# EAGLE design os23dc (EAGLE 7.5.0)
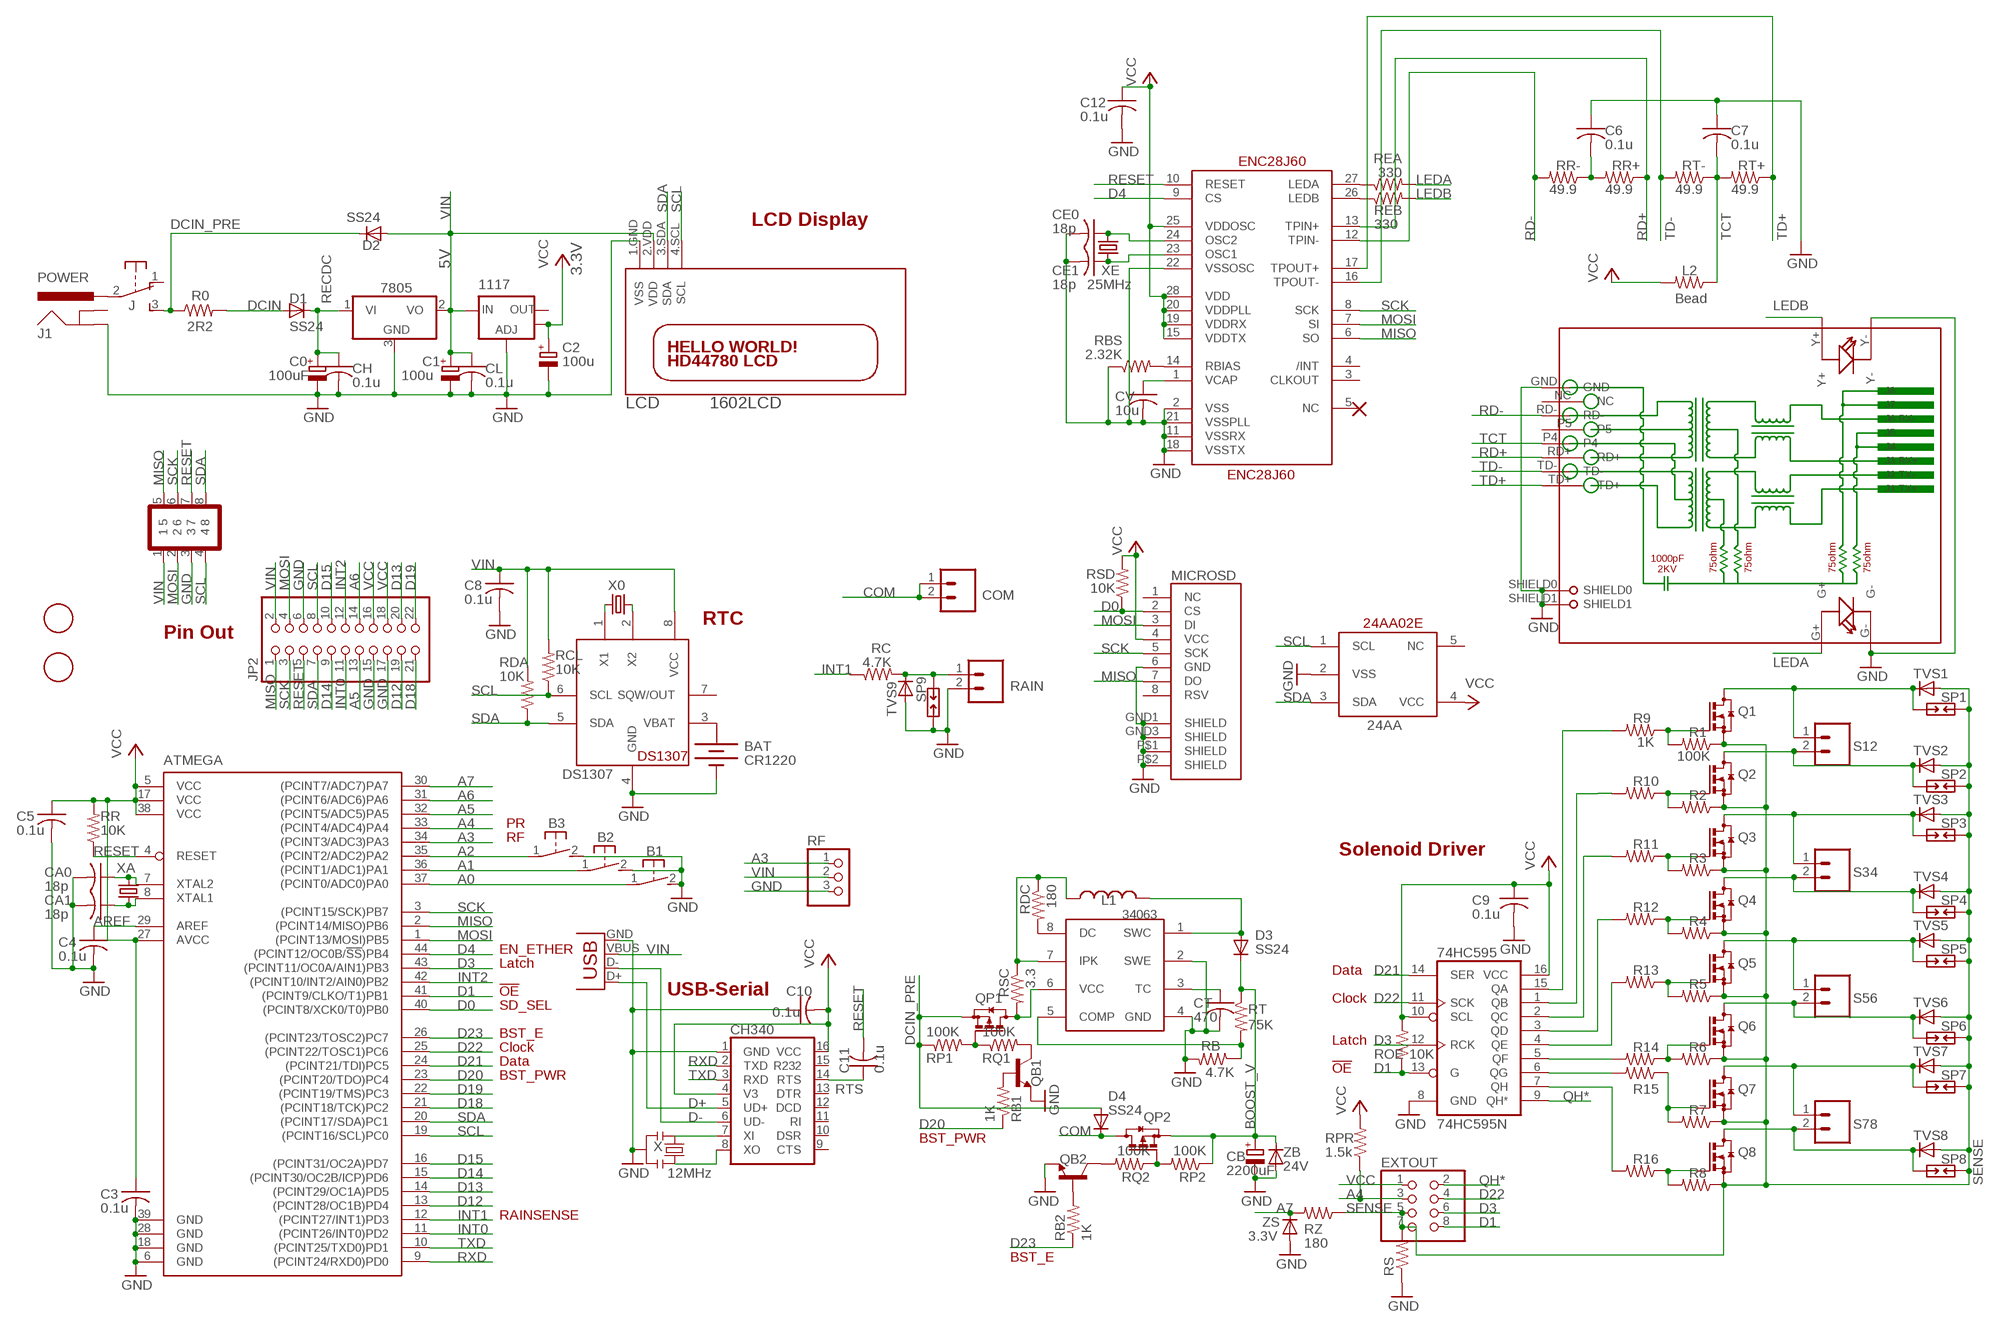
[diagram p0: schematic, sheet 1]

## Parts
24AA  24AA02E48  [SOT23-5L]
74HC595  74HC595N  74LS595D  [SO16]
1117  V_REG_LM1117SOT223  [SOT223]
7805  7805DT  [TO252]
34063  MC33063/MC34063D  [SO08]
ATMEGA  ATMEGA644A  [TQFP44]
B1  31-XX  [B3F-31XX]
B2  31-XX  [B3F-31XX]
B3  31-XX  [B3F-31XX]
BAT  CR1220  BATTERYBATTERY_12MM_SMT  [BATTCON_12MM_SMT]
C0  100uF  CPOL-EUD  [PANASONIC_D]
C1  100u  CPOL-EUD  [PANASONIC_D]
C2  100u  CPOL-EUD  [PANASONIC_D]
C3  0.1u  C-USC0603K  [C0603K]
C4  0.1u  C-USC0603  [C0603]
C5  0.1u  C-USC0603  [C0603]
C6  0.1u  C-USC0603  [C0603]
C7  0.1u  C-USC0603K  [C0603K]
C8  0.1u  C-USC0603  [C0603]
C9  0.1u  C-USC0603  [C0603]
C10  0.1u  C-USC0603  [C0603]
C11  0.1u  C-USC0603  [C0603]
C12  0.1u  C-USC0603  [C0603]
CA0  18p  C-USC0603K  [C0603K]
CA1  18p  C-USC0603K  [C0603K]
CB  2200uF  CPOL-EUE7.5-16  [E7,5-16]
CE0  18p  C-USC0603K  [C0603K]
CE1  18p  C-USC0603K  [C0603K]
CH  0.1u  C-USC0603  [C0603]
CH340  CH340G  [SO16]
CL  0.1u  C-USC0603  [C0603]
COM  M025MM-X  [SCREWTERMINAL-5MM-2-X]
CT  470  C-USC0603K  [C0603K]
CV  10u  C-USC0805K  [C0805K]
D1  SS24  DIODE-DO-214AC  [DO-214AC]
D2  SS24  DIODE-DO-214AC  [DO-214AC]
D3  SS24  DIODE-DO-214AC  [DO-214AC]
D4  SS24  DIODE-DO-214AC  [DO-214AC]
DS1307  DS1307  DS1307SOIC  [SO08]
ENC28J60  ENC28J60  [SSOP28DB]
EXTOUT  PINHD-2X4  [2X04]
J  EG1206  [EG1206]
J1  POWER  POWER_JACKPTH_LOCK  [POWER_JACK_PTH_LOCK]
JP2  PINHD-2X11  [2X11]
L1  INDUCTORCR54  [CR54]
L2  Bead  R-US_R0805  [R0805]
LCD  1602LCD  HD44780LCD-I2CSIDE  [LCD1602-I2C-SIDE]
MICROSD  USD-SOCKETMICRO-SD-SOCKET-TAOBAO  [MICRO-SD-SOCKET-TAOBAO]
Q1  BSS123  [SOT23]
Q2  BSS123  [SOT23]
Q3  BSS123  [SOT23]
Q4  BSS123  [SOT23]
Q5  BSS123  [SOT23]
Q6  BSS123  [SOT23]
Q7  BSS123  [SOT23]
Q8  BSS123  [SOT23]
QB1  TRANSISTOR_NPNSOT23-3  [SOT23-3]
QB2  TRANSISTOR_NPNSOT23-3  [SOT23-3]
QP1  BSS84  [SOT23]
QP2  BSS84  [SOT23]
R0  2R2  R-US_R2512  [R2512]
R1  100K  R-US_R0603  [R0603]
R2  100K  R-US_R0603  [R0603]
R3  100K  R-US_R0603  [R0603]
R4  100K  R-US_R0603  [R0603]
R5  100K  R-US_R0603  [R0603]
R6  100K  R-US_R0603  [R0603]
R7  100K  R-US_R0603  [R0603]
R8  100K  R-US_R0603  [R0603]
R9  1K  R-US_R0603  [R0603]
R10  1K  R-US_R0603  [R0603]
R11  1K  R-US_R0603  [R0603]
R12  1K  R-US_R0603  [R0603]
R13  1K  R-US_R0603  [R0603]
R14  1K  R-US_R0603  [R0603]
R15  1K  R-US_R0603  [R0603]
R16  1K  R-US_R0603  [R0603]
RAIN  M025MM-X  [SCREWTERMINAL-5MM-2-X]
RB  4.7K  R-US_R0603  [R0603]
RB1  1K  R-US_R0603  [R0603]
RB2  1K  R-US_R0603  [R0603]
RBS  2.32K  R-US_R0603  [R0603]
RC  4.7K  R-US_R0603  [R0603]
RCL  10K  R-US_R0603  [R0603]
RDA  10K  R-US_R0603  [R0603]
RDC  180  R-US_R0603  [R0603]
REA  330  R-US_R0603  [R0603]
REB  330  R-US_R0603  [R0603]
RF  PINHD-1X3  [1X03]
RJ45  HR911105A  [HR911105A]
ROE  10K  R-US_R0603  [R0603]
RP1  100K  R-US_R0603  [R0603]
RP2  100K  R-US_R0603  [R0603]
RPR  1.5k  R-US_R0603  [R0603]
RQ1  100K  R-US_R0603  [R0603]
RQ2  100K  R-US_R0603  [R0603]
RR  10K  R-US_R0603  [R0603]
RR+  49.9  R-US_R0603  [R0603]
RR-  49.9  R-US_R0603  [R0603]
RS  R-US_R2512  [R2512]
RSC  3.3  R-US_R0603  [R0603]
RSD  10K  R-US_R0603  [R0603]
RT  75K  R-US_R0603  [R0603]
RT+  49.9  R-US_R0603  [R0603]
RT-  49.9  R-US_R0603  [R0603]
RZ  180  R-US_R0402  [R0402]
S12  M025MM-X  [SCREWTERMINAL-5MM-2-X]
S34  M025MM-X  [SCREWTERMINAL-5MM-2-X]
S56  M025MM-X  [SCREWTERMINAL-5MM-2-X]
S78  M025MM-X  [SCREWTERMINAL-5MM-2-X]
SP1  PCB-SGAP  [PCB-SGAP]
SP2  PCB-SGAP  [PCB-SGAP]
SP3  PCB-SGAP  [PCB-SGAP]
SP4  PCB-SGAP  [PCB-SGAP]
SP5  PCB-SGAP  [PCB-SGAP]
SP6  PCB-SGAP  [PCB-SGAP]
SP7  PCB-SGAP  [PCB-SGAP]
SP8  PCB-SGAP  [PCB-SGAP]
SP9  PCB-SGAP  [PCB-SGAP]
TVS1  DIODE-SMB  [SMB]
TVS2  DIODE-SMB  [SMB]
TVS3  DIODE-SMB  [SMB]
TVS4  DIODE-SMB  [SMB]
TVS5  DIODE-SMB  [SMB]
TVS6  DIODE-SMB  [SMB]
TVS7  DIODE-SMB  [SMB]
TVS8  DIODE-SMB  [SMB]
TVS9  DIODE-SMB  [SMB]
U$1  FIDUCIAL  [FIDUCIAL_1MM]
U$3  FIDUCIAL  [FIDUCIAL_1MM]
U$4  GOLDFINGER_2X4  [GOLDFINGER_2X4]
USB  USBPTH  [USB-B-PTH]
X  12MHz  RESONATORSMD  [RESONATOR-SMD]
X0  32.768kHz  CRYSTALMM20SS  [MM20SS]
XA  16MHz  CRYSTAL4SMD  [4SMD]
XE  25MHz  CRYSTAL4SMD  [4SMD]
ZB  24V  DIODE-MINIMELF  [MINIMELF]
ZS  3.3V  DIODE-MINIMELF  [MINIMELF]

## Nets
A0: ATMEGA.37((PCINT0/ADC0)PA0) B1.1(P)
A1: ATMEGA.36((PCINT1/ADC1)PA1) B2.1(P)
A2: ATMEGA.35((PCINT2/ADC2)PA2) B3.1(P)
A3: ATMEGA.34((PCINT3/ADC3)PA3) RF.1
A4: ATMEGA.33((PCINT4/ADC4)PA4) EXTOUT.3 RPR.1
A5: ATMEGA.32((PCINT5/ADC5)PA5) JP2.13
A6: ATMEGA.31((PCINT6/ADC6)PA6) JP2.14
A7: ATMEGA.30((PCINT7/ADC7)PA7) RZ.2 ZS.C
AREF: ATMEGA.29(AREF) C4.1
BOOST_V: CB.+ D3.C QP2.2(S) RP2.1 RT.1 ZB.C
COM: COM.1 COM.2 D4.C QP2.3(D)
D0: ATMEGA.40((PCINT8/XCK0/T0)PB0) MICROSD.2(CS) RSD.1
D1: 74HC595.13(G) ATMEGA.41((PCINT9/CLKO/T1)PB1) EXTOUT.8 ROE.1
D3: 74HC595.12(RCK) ATMEGA.43((PCINT11/OC0A/AIN1)PB3) EXTOUT.6
D4: ATMEGA.44((PCINT12/OC0B/!SS!)PB4) ENC28J60.9(CS)
D12: ATMEGA.13((PCINT28/OC1B)PD4) JP2.19
D13: ATMEGA.14((PCINT29/OC1A)PD5) JP2.20
D14: ATMEGA.15((PCINT30/OC2B/ICP)PD6) JP2.9
D15: ATMEGA.16((PCINT31/OC2A)PD7) JP2.10
D18: ATMEGA.21((PCINT18/TCK)PC2) JP2.21
D19: ATMEGA.22((PCINT19/TMS)PC3) JP2.22
D20: ATMEGA.23((PCINT20/TDO)PC4) RB1.1
D21: 74HC595.14(SER) ATMEGA.24((PCINT21/TDI)PC5)
D22: 74HC595.11(SCK) ATMEGA.25((PCINT22/TOSC1)PC6) EXTOUT.4
D23: ATMEGA.26((PCINT23/TOSC2)PC7) RB2.1
D+: CH340.5(UD+) USB.D+
D-: CH340.6(UD-) USB.D-
DCIN [power]: D1.A R0.2
DCIN_PRE [power]: D2.C D4.A J.3(S) QP1.2(S) R0.1 RP1.1
GND: 24AA.2(VSS) 74HC595.8(GND) 1117.1(ADJ) 7805.3(GND) 34063.2(SWE) 34063.4(GND) ATMEGA.6(GND) ATMEGA.18(GND) ATMEGA.28(GND) ATMEGA.39(GND) B1.2(S) B2.2(S) B3.2(S) BAT.P$1(-) C0.- C1.- C2.- C3.2 C4.2 C5.2 C6.1 C7.1 C8.2 C9.2 C10.1 C12.2 CA0.2 CA1.2 CB.- CE0.2 CE1.2 CH340.1(GND) CH.2 CL.2 CT.2 CV.2 DS1307.4(GND) ENC28J60.2(VSS) ENC28J60.11(VSSRX) ENC28J60.18(VSSTX) ENC28J60.21(VSSPLL) ENC28J60.22(VSSOSC) J1.GND JP2.6 JP2.15 JP2.17 LCD.1.GND(VSS) MICROSD.6(GND) MICROSD.GND1(SHIELD) MICROSD.GND3(SHIELD) MICROSD.P$1(SHIELD) MICROSD.P$2(SHIELD) QB1.2(E) QB2.2(E) RAIN.2 RB.2 RBS.1 RF.3 RJ45.G- RJ45.GND RJ45.SHIELD0 RJ45.SHIELD1 RJ45.Y- RS.1 SP9.2 TVS9.A U$4.3 USB.GND X.2 ZB.A ZS.A
INT0: ATMEGA.11((PCINT26/INT0)PD2) JP2.11
INT1: ATMEGA.12((PCINT27/INT1)PD3) RC.1
INT2: ATMEGA.42((PCINT10/INT2/AIN0)PB2) JP2.12
LEDA: REA.2 RJ45.G+
LEDB: REB.2 RJ45.Y+
MISO: ATMEGA.2((PCINT14/MISO)PB6) ENC28J60.6(SO) JP2.1 MICROSD.7(DO) U$4.5
MOSI: ATMEGA.1((PCINT13/MOSI)PB5) ENC28J60.7(SI) JP2.4 MICROSD.3(DI) U$4.2
N$1 [power]: J1.PWR J.2(P)
N$2: QP1.1(G) RP1.2 RQ1.1
N$3: RAIN.1 RC.2 SP9.1 TVS9.C
N$4: 74HC595.5(QF) R14.2
N$5: 74HC595.6(QG) R15.2
N$6: CH340.7(XI) X.1
N$7: 74HC595.7(QH) R16.2
N$8: DS1307.1(X1) X0.1
N$9: 34063.1(SWC) D3.A L1.P$2
N$10: 74HC595.4(QE) R13.2
N$11: 74HC595.3(QD) R12.2
N$12: 74HC595.2(QC) R11.2
N$13: 74HC595.1(QB) R10.2
N$14: 74HC595.15(QA) R9.2
N$15: ATMEGA.7(XTAL2) CA0.1 XA.1
N$16 [power]: Q1.3(D) S12.1 SP1.2 TVS1.C
N$17 [power]: Q2.3(D) S12.2 SP2.2 TVS2.C
N$18 [power]: Q3.3(D) S34.1 SP3.2 TVS3.C
N$19: ATMEGA.8(XTAL1) CA1.1 XA.3
N$20 [power]: Q4.3(D) S34.2 SP4.2 TVS4.C
N$21: QB2.3(C) RQ2.2
N$22 [power]: Q5.3(D) S56.1 SP5.2 TVS5.C
N$23 [power]: Q6.3(D) S56.2 SP6.2 TVS6.C
N$24 [power]: Q7.3(D) S78.1 SP7.2 TVS7.C
N$25 [power]: Q8.3(D) S78.2 SP8.2 TVS8.C
N$26: 34063.7(IPK) L1.P$1 RDC.1 RSC.1
N$27: 34063.6(VCC) QP1.3(D) RSC.2
N$28: 34063.3(TC) CT.1
N$29: 34063.5(COMP) RB.1 RT.2
N$30: DS1307.2(X2) X0.4
N$31: 34063.8(DC) RDC.2
N$32: QB1.1(B) RB1.2
N$33: QB1.3(C) RQ1.2
N$34: ENC28J60.27(LEDA) REA.1
N$35: Q1.1(G) R1.2 R9.1
N$36: BAT.P$2(+) DS1307.3(VBAT)
N$37: ENC28J60.26(LEDB) REB.1
N$38: QP2.1(G) RP2.2 RQ2.1
N$39: CV.1 ENC28J60.1(VCAP)
N$40: CH340.8(XO) X.3
N$41: CE0.1 ENC28J60.24(OSC2) XE.3
N$42: CE1.1 ENC28J60.23(OSC1) XE.1
N$43: QB2.1(B) RB2.2
N$44: Q2.1(G) R2.2 R10.1
N$45: Q3.1(G) R3.2 R11.1
N$46: Q4.1(G) R4.2 R12.1
N$47: Q5.1(G) R5.2 R13.1
N$48: Q6.1(G) R6.2 R14.1
N$49: Q7.1(G) R7.2 R15.1
N$50: Q8.1(G) R8.2 R16.1
N$54: C6.2 RR+.2 RR-.1
N$59: ENC28J60.14(RBIAS) RBS.2
QH*: 74HC595.9(QH*) EXTOUT.2
RD+: ENC28J60.13(TPIN+) RJ45.RD+ RR+.1
RD-: ENC28J60.12(TPIN-) RJ45.RD- RR-.2
RECDC [power]: 7805.1(VI) C0.+ CH.1 D1.C
RESET: ATMEGA.4(RESET) C11.2 ENC28J60.10(RESET) JP2.5 RR.1 U$4.7
RTS: C11.1 CH340.14(RTS)
RXD: ATMEGA.9((PCINT24/RXD0)PD0) CH340.2(TXD)
SCK: ATMEGA.3((PCINT15/SCK)PB7) ENC28J60.8(SCK) JP2.3 MICROSD.5(SCK) U$4.6
SCL: 24AA.1(SCL) ATMEGA.19((PCINT16/SCL)PC0) DS1307.6(SCL) JP2.8 LCD.4.SCL(SCL) RCL.1 U$4.4
SDA: 24AA.3(SDA) ATMEGA.20((PCINT17/SDA)PC1) DS1307.5(SDA) JP2.7 LCD.3.SDA(SDA) RDA.1 U$4.8
SENSE: EXTOUT.5 EXTOUT.7 Q1.2(S) Q2.2(S) Q3.2(S) Q4.2(S) Q5.2(S) Q6.2(S) Q7.2(S) Q8.2(S) R1.1 R2.1 R3.1 R4.1 R5.1 R6.1 R7.1 R8.1 RS.2 RZ.1 SP1.1 SP2.1 SP3.1 SP4.1 SP5.1 SP6.1 SP7.1 SP8.1 TVS1.A TVS2.A TVS3.A TVS4.A TVS5.A TVS6.A TVS7.A TVS8.A
TCT: C7.2 L2.1 RJ45.P4 RT+.2 RT-.1
TD+: ENC28J60.17(TPOUT+) RJ45.TD+ RT+.1
TD-: ENC28J60.16(TPOUT-) RJ45.TD- RT-.2
TXD: ATMEGA.10((PCINT25/TXD0)PD1) CH340.3(RXD)
VCC: 24AA.4(VCC) 74HC595.10(SCL) 74HC595.16(VCC) 1117.4(OUT) ATMEGA.5(VCC) ATMEGA.17(VCC) ATMEGA.27(AVCC) ATMEGA.38(VCC) C2.+ C3.1 C5.1 C9.1 C10.2 C12.1 CH340.4(V3) CH340.16(VCC) ENC28J60.15(VDDTX) ENC28J60.19(VDDRX) ENC28J60.20(VDDPLL) ENC28J60.25(VDDOSC) ENC28J60.28(VDD) EXTOUT.1 JP2.16 JP2.18 L2.2 MICROSD.4(VCC) ROE.2 RPR.2 RR.2 RSD.2
VIN [power]: 1117.3(IN) 7805.2(VO) C1.+ C8.1 CL.1 D2.A DS1307.8(VCC) JP2.2 LCD.2.VDD(VDD) RCL.2 RDA.2 RF.2 U$4.1 USB.VBUS
Unconnected: 24AA.5(NC) 1117.2(OUT) CH340.9(CTS) CH340.10(DSR) CH340.11(RI) CH340.12(DCD) CH340.13(DTR) CH340.15(R232) DS1307.7(SQW/OUT) ENC28J60.3(CLKOUT) ENC28J60.4(/INT) ENC28J60.5(NC) J1.GNDBREAK J.1(O) MICROSD.1(NC) MICROSD.8(RSV) RJ45.NC RJ45.P5

## Notes on the sheet
- LCD Display
- 5V
- 3.3V
- RTC
- Pin Out
- PR
- RF
- Solenoid Driver
- EN_ETHER
- Latch
- Data
- !OE | USB-Serial
- Clock
- SD_SEL
- BST_E
- Latch
- Clock
- Data
- !OE
- BST_PWR
- BST_PWR
- RAINSENSE
- BST_E

## Library data of the parts
24AA = adafruit:24AA02E48
74HC595 = SparkFun:74*595: 8-bit SHIFT REGISTER, output latch
1117 = SparkFun:V_REG_LM1117: Voltage Regulator LM1117 Standard adjustable voltage regulator but in SMD form. Spark Fun Electronics SKU : COM-00595
7805 = linear:78*: Positive VOLTAGE REGULATOR Source: http://cache.national.com/ds/LM/LM78L05.pdf http://www.fairchildsemi.com/ds/LM/LM7805.pdf
34063 = adafruit:MC33063/MC34063: MC33063 and MC34063 Basic DC/DC converter with internal power-NPN transistor, 100KHz, 1.5A peak switch current. 3-40 input/output.
ATMEGA = atmel:ATMEGA644: 8-bit Microcontroller with 64K Bytes In-System Programmable Flash Source: http://www.atmel.com/dyn/resources/prod_documents/doc2593.pdf; MPN: ATMEGA644PV-10AU; OC_FARNELL: 1455123; OC_NEWARK: 58M3748
B1-B3 = adafruit:31-XX: OMRON SWITCH Now with beefier pads!
BAT = SparkFunNew:BATTERY: Battery Holders Various common sizes : AA, AAA, 20mm coin cell and 12mm coin cell.
C0 C1 C2 = resistor:CPOL-EU: POLARIZED CAPACITOR, European symbol
C3-C12 CA0 CA1 CE0 CE1 CH CL CT CV = adafruit:C-US: CAPACITOR, American symbol
CB = rcl:CPOL-EU: POLARIZED CAPACITOR, European symbol
CH340 = SparkFunNew:CH340
COM RAIN S12 S34 S56 S78 = SparkFun:M02: Header 2 Standard 2-pin 0.1" header. Use with straight break away headers (SKU : PRT-00116), right angle break away headers (PRT-00553), swiss pins (PRT-00743), machine pins (PRT-00117), and female headers (PRT-00115). Molex polarized connector foot print use with SKU : PRT-08233 with associated crimp pins and housings.
D1-D4 TVS1-TVS9 ZB ZS = diode:DIODE-: DIODE
DS1307 = adafruit:DS1307: DS1307 Real time clock (RTC) with battery backup ability. Talk to it via i2c
ENC28J60 = SparkFun:ENC28J60
EXTOUT = pinhead:PINHD-2X4: PIN HEADER
J = adafruit:EG1206
J1 = SparkFunNew:POWER_JACK: Power Jack This is the standard 5.5mm barrel jack for power. The PTH is the most common, proven, reliable, footprint. All others are experimental. The Slot footprint only works if the mill layer is transmitted to the PCB fab house so be warned. Spark Fun Electronics SKU : PRT-00119. Mating wall wart : TOL-00298 (and others)
JP2 = pinhead:PINHD-2X11: PIN HEADER
L1 = SparkFunNew:INDUCTOR: Inductors Basic Inductor/Choke - 0603 and 1206. Footprints are not proven and vary greatly between part numbers.
L2 R1-R16 RC RCL RDA ROE RPR RR RS RSD = adafruit2013:R-US_: RESISTOR, American symbol
LCD = adafruit:HD44780LCD-I2C
MICROSD = SparkFunNew:USD-SOCKET: microSD Socket Push-push type uSD socket. Schematic element and footprint production proven. Spark Fun Electronics SKU : PRT-00127. tDoc lines correctly indicate media card edge positions when inserting (unlocked, locked, depressed).
Q1-Q8 = transistor-small-signal:BSS123: N-CHANNEL MOS FET
QB1 QB2 = SparkFunNew:TRANSISTOR_NPN: Transistor NPN BJT configuration in SOT23 package. MMBT2222 is the common NPN we use. Double check BCE configuration again layout.
QP1 QP2 = transistor-small-signal:BSS84: P-CHANNEL MOS FET
R0 RB RB1 RB2 RBS RDC REA REB RP1 RP2 RQ1 RQ2 RR+ RR- RSC RT RT+ RT- RZ = adafruitGood:R-US_: RESISTOR, American symbol
RF = pinhead:PINHD-1X3: PIN HEADER
RJ45 = CONNECTER:HR911105A
SP1-SP9 = varistor:PCB-SGAP
U$1 U$3 = adafruitGood:FIDUCIAL: For use by pick and place machines to calibrate the vision/machine, 1mm By microbuilder.eu
U$4 = SparkFunNew:GOLDFINGER_2X4
USB = SparkFunNew:USB: USB Connectors USB-B-PTH is fully proven SKU : PRT-00139 USB-miniB is fully proven SKU : PRT-00587 USB-A-PCB is untested. USB-A-H is throughly reviewed, but untested. Spark Fun Electronics SKU : PRT-00437 USB-B-SMT is throughly reviewed, but untested. Needs silkscreen touching up. USB-A-S has not been used/tested USB-MB-H has not been used/tested
X = SparkFunNew:RESONATOR: Resonator Small SMD resonator. This is the itty bitty 10/20MHz resonators with built in caps. CSTCE10M0G55 and CSTCE20M0V53. Footprint has been reviewed closely but hasn't been tested yet.
X0 = crystal:CRYSTAL: CRYSTAL; OC_FARNELL: unknown; OC_NEWARK: unknown
XA XE = adafruit_3:CRYSTAL: CRYSTAL

## Net classes
0 default: width 0.203 mm, clearance 0.178 mm
1 power: width 0.305 mm, clearance 0.178 mm
2 relaypower: width 0.813 mm, clearance 0.305 mm

## Board
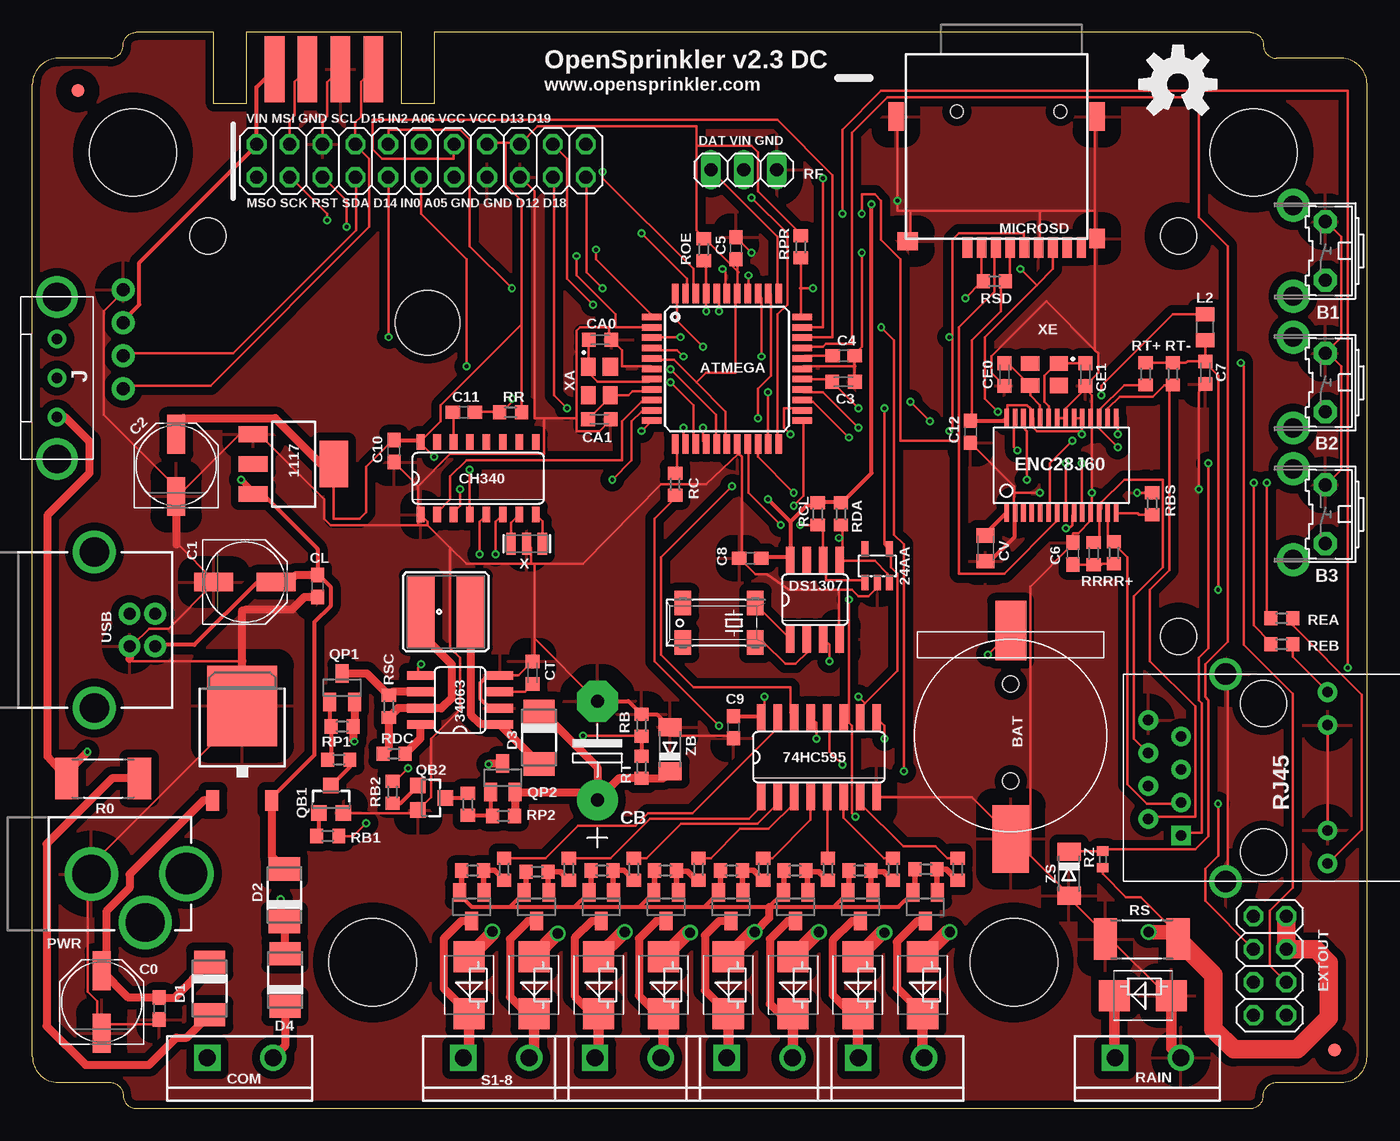
[diagram p1: board, top side]
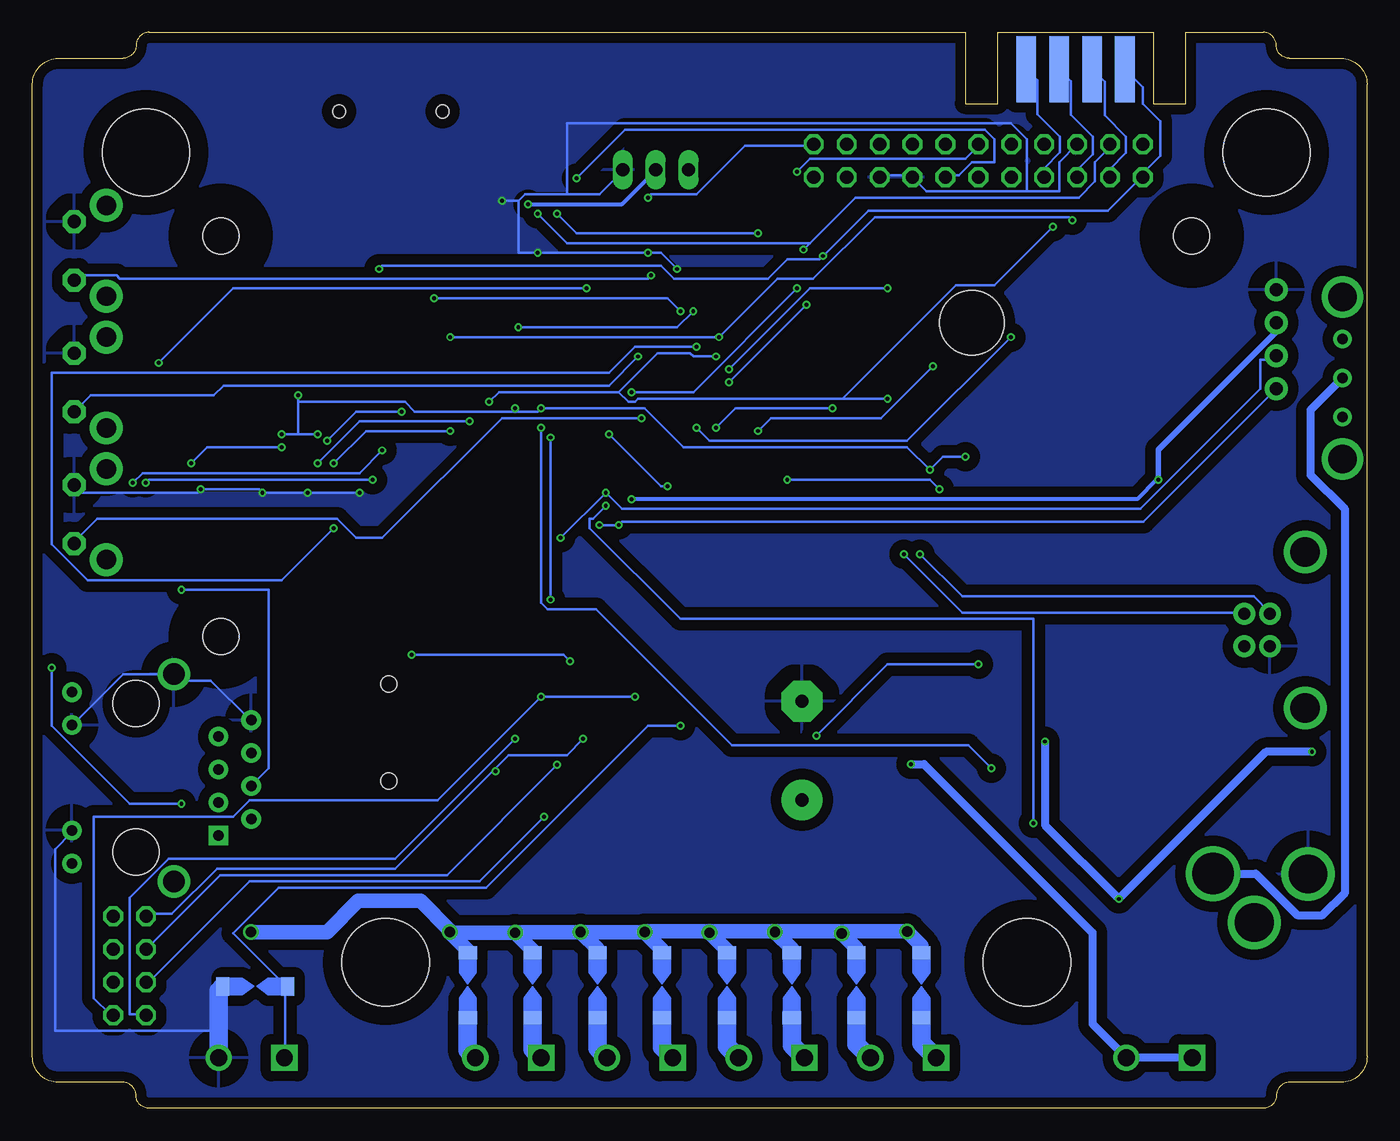
[diagram p2: board, bottom side, seen from below]

Size 103 x 83 mm. Coordinates in mm from the lower left corner, seen from the top.
Outline: 101,81 96,81 arc-90 95,82 arc90 94,83 31,83 31,77.5 28.5,77.5 28.5,83 16.5,83 16.5,77.5 14,77.5 14,83 8,83 arc90 7,82 arc-90 6,81 2,81 arc90 0,79 0,4 arc90 2,2 6,2 arc-90 7,1 arc90 8,0 94,0 arc90 95,1 arc-90 96,2 101,2 arc90 103,4 103,79 arc90 101,81
Copper layers (1*16): Top 0.035mm / dielectric 1.5mm / Bottom 0.035mm
Design rules "Fusion_eagle_rule_v1.1 *": minimum track width 6mil, minimum drill 12mil, track to track 6mil, track to pad 6mil, pad to pad 6mil, via to via 6mil, smd to smd 0mil, copper to edge 10mil, drill to drill 10mil, minimum pad ring 10mil, minimum via ring 6mil, stop-mask expansion 2mil, vias tented up to drill 100mil, thermal gap 50mil
Holes 6.75 mm at 7.76,73.74 94.24,73.74 26.26,11.26 75.74,11.26
Holes 5 mm at 30.5,60.6
tRestrict: area 3.8,69.7 to 11.8,77.7; area 90.2,69.7 to 98.2,77.7; area 22.3,7.3 to 30.3,15.3; area 71.7,7.3 to 79.7,15.3
bRestrict: area 3.8,69.7 to 11.8,77.7; area 90.2,69.7 to 98.2,77.7; area 22.3,7.3 to 30.3,15.3; area 71.7,7.3 to 79.7,15.3

### Footprints (pad centres in the part's own frame; a part is rotated, then mirrored left to right if it is on the bottom)
SOT23-5L = smd 0.55 x 1.2: 1 -0.95,-1.3; 2 0,-1.3; 3 0.95,-1.3; 4 0.95,1.3; 5 -0.95,1.3
SO16 = smd 0.66 x 2.032: 1 -4.445,-3.073; 2 -3.175,-3.073; 3 -1.905,-3.073; 4 -0.635,-3.073; 5 0.635,-3.073; 6 1.905,-3.073; 7 3.175,-3.073; 8 4.445,-3.073; 9 4.445,3.073; 10 3.175,3.073; 11 1.905,3.073; 12 0.635,3.073; 13 -0.635,3.073; 14 -1.905,3.073; 15 -3.175,3.073; 16 -4.445,3.073
SOT223 = smd 1.219 x 2.235: 1 -2.311,-3.099; 2 0,-3.099; 3 2.311,-3.099 | smd 3.6 x 2.2: 4 0,3.099
TO252 = smd 1 x 1.6: 1 -2.28,-4.8; 2 2.28,-4.8 | smd 5.4 x 6.2: 3 0,2.5
SO08 = smd 0.66 x 2.032: 1 -1.905,-3.073; 2 -0.635,-3.073; 3 0.635,-3.073; 4 1.905,-3.073; 5 1.905,3.073; 6 0.635,3.073; 7 -0.635,3.073; 8 -1.905,3.073
TQFP44 = smd 1.5 x 0.5: 1 -5.8,4; 2 -5.8,3.2; 3 -5.8,2.4; 4 -5.8,1.6; 5 -5.8,0.8; 6 -5.8,0; 7 -5.8,-0.8; 8 -5.8,-1.6; 9 -5.8,-2.4; 10 -5.8,-3.2; 11 -5.8,-4; 23 5.8,-4; 24 5.8,-3.2; 25 5.8,-2.4; 26 5.8,-1.6; 27 5.8,-0.8; 28 5.8,0; 29 5.8,0.8; 30 5.8,1.6; 31 5.8,2.4; 32 5.8,3.2; 33 5.8,4 | smd 0.5 x 1.5: 12 -4,-5.8; 13 -3.2,-5.8; 14 -2.4,-5.8; 15 -1.6,-5.8; 16 -0.8,-5.8; 17 0,-5.8; 18 0.8,-5.8; 19 1.6,-5.8; 20 2.4,-5.8; 21 3.2,-5.8; 22 4,-5.8; 34 4,5.8; 35 3.2,5.8; 36 2.4,5.8; 37 1.6,5.8; 38 0.8,5.8; 39 0,5.8; 40 -0.8,5.8; 41 -1.6,5.8; 42 -2.4,5.8; 43 -3.2,5.8; 44 -4,5.8
B3F-31XX = drill 1.016 pad 1.778 octagon: 1 -2.261,-1.245; 2 2.261,-1.245 | drill 1.499 pad 2.54: 3 -3.505,1.245; 4 3.505,1.245
BATTCON_12MM_SMT = smd 2.8 x 5.2: P$1 0,11.96 | smd 2.4 x 4.6: P$2 0,-4.1 | hole 1.25: 0,7.5; 0,0
PANASONIC_D = smd 3 x 1.4: + 2.4,0; - -2.4,0
C0603K = smd 1.05 x 1.08: 1 -0.875,0; 2 0.875,0
C0603 = smd 1.1 x 1: 1 -0.85,0; 2 0.85,0
E7,5-16 = drill 1.016 pad 3.15: + -3.81,0 | drill 1.016 pad 3.15 octagon: - 3.81,0
SO16' = smd 0.6 x 1.2: 1 -4.445,-2.8; 2 -3.175,-2.8; 3 -1.905,-2.8; 4 -0.635,-2.8; 5 0.635,-2.8; 6 1.905,-2.8; 7 3.175,-2.8; 8 4.445,-2.8; 9 4.445,2.8; 10 3.175,2.8; 11 1.905,2.8; 12 0.635,2.8; 13 -0.635,2.8; 14 -1.905,2.8; 15 -3.175,2.8; 16 -4.445,2.8
SCREWTERMINAL-5MM-2-X = drill 1.3 pad 2.032 square: 1 0,0 | drill 1.3 pad 2.032: 2 5.08,0
C0805K = smd 1.1 x 1.4: 1 -1,0; 2 1,0
DO-214AC = smd 1.8 x 2.4: A 2.025,0; C -2.025,0
SSOP28DB = smd 0.348 x 1.397: 1 -4.225,-3.656; 2 -3.575,-3.656; 3 -2.925,-3.656; 4 -2.275,-3.656; 5 -1.625,-3.656; 6 -0.975,-3.656; 7 -0.325,-3.656; 8 0.325,-3.656; 9 0.975,-3.656; 10 1.625,-3.656; 11 2.275,-3.656; 12 2.925,-3.656; 13 3.575,-3.656; 14 4.225,-3.656; 15 4.225,3.656; 16 3.575,3.656; 17 2.925,3.656; 18 2.275,3.656; 19 1.625,3.656; 20 0.975,3.656; 21 0.325,3.656; 22 -0.325,3.656; 23 -0.975,3.656; 24 -1.625,3.656; 25 -2.275,3.656; 26 -2.925,3.656; 27 -3.575,3.656; 28 -4.225,3.656
2X04 = drill 1.016 octagon: 1 -3.81,-1.27; 2 -3.81,1.27; 3 -1.27,-1.27; 4 -1.27,1.27; 5 1.27,-1.27; 6 1.27,1.27; 7 3.81,-1.27; 8 3.81,1.27
EG1206 = drill 0.8 pad 1.422: 1 -3,0; 2 0,0; 3 3,0 | drill 2.2: MT1 -6.25,0; MT2 6.25,0
POWER_JACK_PTH_LOCK = drill 2.997 pad 4.115: GND 0.025,6.557; GNDBREAK 3.762,10.7 | drill 3.2 pad 4.115: PWR 0,13.878
2X11 = drill 1.016 octagon: 1 -12.7,-1.27; 2 -12.7,1.27; 3 -10.16,-1.27; 4 -10.16,1.27; 5 -7.62,-1.27; 6 -7.62,1.27; 7 -5.08,-1.27; 8 -5.08,1.27; 9 -2.54,-1.27; 10 -2.54,1.27; 11 0,-1.27; 12 0,1.27; 13 2.54,-1.27; 14 2.54,1.27; 15 5.08,-1.27; 16 5.08,1.27; 17 7.62,-1.27; 18 7.62,1.27; 19 10.16,-1.27; 20 10.16,1.27; 21 12.7,-1.27; 22 12.7,1.27
CR54 = smd 5.5 x 2.15: P$1 0,1.92; P$2 0,-1.92
R0805 = smd 1.1 x 1.4: 1 -1,0; 2 1,0
LCD1602-I2C-SIDE = drill 1 pad 1.778: 1.GND -4,29.3; 2.VDD -4,26.76; 3.SDA -4,24.22; 4.SCL -4,21.68 | hole 2.8: 2.54,33.46; 77.46,33.46; 77.46,2.54
MICRO-SD-SOCKET-TAOBAO = smd 0.75 x 1.6: 1 2.25,10.5; 2 1.15,10.5; 3 0.05,10.5; 4 -1.05,10.5; 5 -2.15,10.5; 6 -3.25,10.5; 7 -4.35,10.5; 8 -5.45,10.5 | smd 0.7 x 1.6: CD -6.55,10.5 | smd 1.2 x 1.5: GND1 -7.75,9.8 | smd 1.6 x 1.4: GND3 6.85,10 | smd 1.2 x 2.2: P$1 7.75,0.4; P$2 -7.75,0.4 | hole 1: 3.05,0; -4.93,0
SOT23 = smd 1 x 1.4: 1 -0.95,-1.1; 2 0.95,-1.1; 3 0,1.1
SOT23-3 = smd 1.2 x 1.2: 1 -0.95,-1; 2 0.95,-1; 3 0,1.1
R2512 = smd 1.8 x 3.2: 1 -2.8,0; 2 2.8,0
R0603 = smd 1 x 1.1: 1 -0.85,0; 2 0.85,0
1X03 = drill 1.016 long: 1 -2.54,0; 2 0,0; 3 2.54,0
HR911105A = drill 0.813 pad 1.524: G+ 4.953,-6.604; G- 4.953,-4.064; GND -8.89,4.445; NC -6.35,3.175; P4 -8.89,-0.635; P5 -6.35,0.635; RD+ -6.35,-1.905; RD- -8.89,1.905; TD- -8.89,-3.175; Y+ 4.953,6.604; Y- 4.953,4.064 | drill 1.651 pad 2.159: SHIELD0 -2.921,8.001; SHIELD1 -2.921,-8.001 | drill 0.813 pad 1.524 square: TD+ -6.35,-4.445 | hole 3.556: 0,-5.715; 0,5.715
R0402 = smd 0.7 x 0.9: 1 -0.65,0; 2 0.65,0
PCB-SGAP = smd 1 x 1.4 bottom: 1 -2.5,0; 2 2.5,0
SMB = smd 2.4 x 2.4: A 2.2,0; C -2.2,0
FIDUCIAL_1MM = smd 1 x 1: 1 0,0
GOLDFINGER_2X4 = smd 1.524 x 5.08: 1 -3.81,-2.54; 2 -1.27,-2.54; 3 1.27,-2.54; 4 3.81,-2.54 | smd 1.524 x 5.08 bottom: 5 -3.81,-2.54; 6 -1.27,-2.54; 7 1.27,-2.54; 8 3.81,-2.54
USB-B-PTH = drill 0.914 pad 1.676: D+ 0,1.25; D- 1.981,1.25; GND 0,-1.25; VBUS 1.981,-1.25 | drill 2.286: S1 -2.718,-6.02; S2 -2.718,6.02
RESONATOR-SMD = smd 0.7 x 1.7: 1 -1.2,0; 2 0,0; 3 1.2,0
MM20SS = smd 1.27 x 1.88: 1 -2.794,-1.524; 2 2.794,-1.524; 3 2.794,1.524; 4 -2.794,1.524
4SMD = smd 1.4 x 1.12: 1 -1.1,-0.85; 3 1.1,0.85 | smd 1.4 x 1.1: 2 1.1,-0.85 | smd 1.4 x 1.2: 4 -1.1,0.85
MINIMELF = smd 1.4 x 1.8: A 1.7,0; C -1.7,0

### Placement (x,y rotation side)
24AA  65.2,41.85 0 top
74HC595  60.7,27.1 0 top
1117  20.15,49.7 270 top
7805  16.2,28.55 0 top
34063  33,31.5 90 top
ATMEGA  53.6,57.05 0 top
B1  98.54,66.15 90 top
B2  98.54,55.99 90 top
B3  98.54,45.83 90 top
BAT  75.5,32.75 180 top
C0  5.35,8.2 90 top
C1  16.4,40.6 0 top
C2  11.1,49.6 90 top
C3  62.6,56.05 0 top
C4  62.6,58.05 0 top
C5  54.3,66.35 90 top
C6  80.3,42.8 270 top
C7  90.5,56.75 90 top
C8  55.4,42.45 180 top
C9  54.1,29.4 270 top
C10  27.9,50.7 90 top
C11  33.3,53.7 0 top
C12  72.4,52.2 270 top
CA0  43.8,59.3 0 top
CA1  43.75,53.15 0 top
CB  43.6,27.6 90 top
CE0  75,56.6 270 top
CE1  81.25,56.6 270 top
CH  9.8,7.7 270 top
CH340  [SO16']  34.4,48.6 0 top
CL  22,40.3 270 top
COM  13.5,3.9 0 top
CT  38.6,33.6 90 top
CV  73.55,43.2 270 top
D1  13.68,9.25 270 top
D2  19.45,16.45 90 top
D3  39.1,28.6 270 top
D4  19.5,9.9 90 top
DS1307  60.4,39.25 0 top
ENC28J60  79.4,49.6 0 top
EXTOUT  95.5,11 90 top
J  1.9,56.34 270 top
J1  -2,18.1 270 top
JP2  30,73.1 0 top
L1  31.9,38.3 90 top
L2  90.5,60.25 90 top
LCD  11,33.84 0 top
MICROSD  74.4,76.9 180 top
Q1  33.9,15.55 180 top
Q2  38.9,15.55 180 top
Q3  43.9,15.55 180 top
Q4  48.9,15.55 180 top
Q5  53.9,15.55 180 top
Q6  58.9,15.55 180 top
Q7  63.9,15.55 180 top
Q8  68.9,15.55 180 top
QB1  23.05,23.8 0 top
QB2  30.75,23.95 270 top
QP1  23.9,32.45 0 top
QP2  36.3,25.5 0 top
R0  5.45,25.45 0 top
R1  33.95,18.35 0 top
R2  38.95,18.25 0 top
R3  43.95,18.35 0 top
R4  48.85,18.35 0 top
R5  53.95,18.35 0 top
R6  58.85,18.35 0 top
R7  63.85,18.35 0 top
R8  68.95,18.45 0 top
R9  36.4,18.45 90 top
R10  41.4,18.45 90 top
R11  46.4,18.45 90 top
R12  51.4,18.45 90 top
R13  56.4,18.45 90 top
R14  61.4,18.45 90 top
R15  66.4,18.45 90 top
R16  71.4,18.45 90 top
RAIN  83.55,3.9 0 top
RB  47,29.55 90 top
RB1  22.8,21 180 top
RB2  27.8,24.4 270 top
RBS  86.4,46.65 270 top
RC  49.6,48.15 270 top
RCL  60.6,45.85 90 top
RDA  62.4,45.85 90 top
RDC  27.9,27.35 0 top
REA  96.4,37.8 0 top
REB  96.4,35.8 0 top
RF  54.9,72.4 0 top
RJ45  95,25.5 0 top
ROE  51.8,66.25 90 top
RP1  23.9,29.45 180 top
RP2  36.35,22.55 180 top
RPR  59.3,66.45 90 top
RQ1  23.65,26.9 0 top
RQ2  33.6,23.45 90 top
RR  36.9,53.7 0 top
RR+  83.45,42.85 270 top
RR-  81.9,42.8 90 top
RS  85.6,13.05 0 top
RSC  27.5,31 90 top
RSD  74.25,63.8 0 top
RT  47,26.3 90 top
RT+  85.9,56.65 90 top
RT-  88,56.65 270 top
RZ  82.6,19.2 90 top
S12  33.26,3.9 0 top
S34  43.42,3.9 0 top
S56  53.58,3.9 0 top
S78  63.74,3.9 0 top
SP1  34.4,9.5 270 top
SP2  39.4,9.5 270 top
SP3  44.4,9.5 270 top
SP4  49.4,9.5 270 top
SP5  54.4,9.5 270 top
SP6  59.4,9.5 270 top
SP7  64.4,9.5 270 top
SP8  69.4,9.5 270 top
SP9  85.8,9.4 0 top
TVS1  33.7,9.5 90 top
TVS2  38.7,9.5 90 top
TVS3  43.7,9.5 90 top
TVS4  48.7,9.5 90 top
TVS5  53.7,9.5 90 top
TVS6  58.7,9.5 90 top
TVS7  63.7,9.5 90 top
TVS8  68.7,9.5 90 top
TVS9  85.7,8.7 0 top
U$1  3.5,78.5 90 top
U$3  100.5,4.5 0 top
U$4  22.5,82.7 0 top
USB  7.5,36.9 0 top
X  38.15,43.55 0 top
X0  53,37.45 180 top
XA  43.75,56.1 270 top
XE  78.1,56.6 180 top
ZB  49.2,27.7 90 top
ZS  80,18.1 270 top

### Tracks (layer width: path | path; a pad name or v marks a point on that pad's centre or on a via)
A0  (via drill 0.3)
  Top 0.203: v55.25,64.25 55.25,63 ATMEGA.37
  Bottom 0.203: v55.25,64.25 55.5,64 96.25,64 96.5,64.25 99.5,64.25 99.75,64 B1.1
A1  (via drill 0.3)
  Top 0.203: v56.25,58 56.25,62.5 56,62.75 ATMEGA.36
  Bottom 0.203: v56.25,58 58.5,55.75 88.25,55.75 89,55 98.5,55 99.75,53.75 B2.1
A2  (via drill 0.3)
  Top 0.203: v56,53.25 56,55.5 57,56.5 57,62.75 ATMEGA.35
  Bottom 0.203: v56,53.25 66.75,53.25 76,44 78,44 79.5,45.5 98,45.5 99.75,43.75 B3.1
A3
  Top 0.203: ATMEGA.34 57.5,63 57.5,67.25 52.5,72.25 RF.1
A4  (via drill 0.3)
  Top 0.203: RPR.1 59.3,63.25 | 59.3,63.25 59.3,61.15 ATMEGA.33 | v60.25,63.25 59.3,63.25 | v93.25,57.5 93.5,57.25 93.5,35.75 97.25,32 97.25,17 95.5,15.25 95.5,11 EXTOUT.3 | 59.25,63.25 59.3,63.25
  Bottom 0.203: v60.25,63.25 87.5,63.25 v93.25,57.5
A5  (via drill 0.3)
  Top 0.203: ATMEGA.32 61,60.25 v61,71.75
  Bottom 0.203: v61,71.75 57.25,75.5 29.5,75.5 28.75,74.75 28.75,73 30.5,73 31.5,72 32.5,72 JP2.13
A6
  Top 0.203: ATMEGA.31 59.5,59.5 61.75,59.5 61.75,72 57.5,76.25 26.25,76.25 26.25,74 27,73.25 32.5,73.25 32.5,74.25 JP2.14
A7
  Top 0.203: ZS.C 80.05,19.85 RZ.2 82.75,20 89.75,20 90.75,21 90.75,31.5 90.5,31.75 90.5,34.25 92.25,36 92.25,66.5 90,68.75 90,78 66,78 63.25,75.25 63.25,59 61.25,59 61,58.75 59.5,58.75 ATMEGA.30
AREF
  Top 0.203: C4.1 59.6,58.05 ATMEGA.29
BOOST_V
  Top 0.61: RP2.1 37.25,22.6 QP2.2 42.99,24.4 CB.+ | D3.C 39.27,30.62 43.6,26.3 CB.+ | CB.+ 45.26,25.45 RT.1 48.65,25.45 ZB.C
COM  (via drill 0.3)
  Top 0.61: D4.C 19.5,4.82 COM.2 | QP2.3 35.25,26.6 v35.2,26.55
  Bottom 0.61: COM.1 COM.2 21.2,6.52 21.2,13.55 34.2,26.55 v35.2,26.55
D0  (via drill 0.3)
  Top 0.203: MICROSD.2 73.25,63.95 RSD.1 73.25,63.75 v72,62.5 | v53,61.5 53,62.75 ATMEGA.40
  Bottom 0.203: v53,61.5 54,62.5 v72,62.5
D1  (via drill 0.3)
  Top 0.203: ROE.1 52,65.2 ATMEGA.41 v52,61.5 | v60.5,28.5 60.5,29.75 60.25,30 74HC595.13 | v65.5,60.25 66.5,59.25 66.5,44.25 67.25,43.5 v67.25,26
  Bottom 0.203: v60.5,28.5 61.75,27.25 66.25,27.25 67.25,26.25 | 67.25,26.25 75,18.5 88.75,18.5 92.25,15 94,15 EXTOUT.8 | v52,61.5 53.25,60.25 v65.5,60.25 | 67.25,26.25 v67.25,26
D3  (via drill 0.3)
  Top 0.203: v62.5,26.5 61.5,27.5 61.5,30 74HC595.12 | v47,67.5 50.5,64 50.5,63 ATMEGA.43 | v62.5,69 62.5,75.5 65.5,78.5 101.5,78.5 v101.5,34 | v91.5,23.5 91.5,19.5 90.5,18.5 90.5,16 EXTOUT.6
  Bottom 0.203: EXTOUT.6 88.5,18 71,18 v62.5,26.5 | v47,67.5 61,67.5 v62.5,69 | v101.5,34 101.5,29.5 95.5,23.5 v91.5,23.5
D4  (via drill 0.3)
  Top 0.203: v79.75,44.75 80,44.75 80.25,45 80.25,45.75 ENC28J60.9 | v51.75,58.75 49.75,60.75 49.75,62.75 ATMEGA.44
  Bottom 0.203: v79.75,44.75 83.75,40.75 98.75,40.75 101.5,43.5 101.5,56.75 58.5,56.75 56.5,58.75 v51.75,58.75
D12  (via drill 0.3)
  Top 0.203: v50.25,52.5 50.25,51.25 ATMEGA.13 | v41.25,54 40.25,55 40.25,71.75 JP2.19
  Bottom 0.203: v50.25,52.5 48.75,54 v41.25,54
D13  (via drill 0.3)
  Top 0.203: v49.25,56 51,54.25 51,51.25 ATMEGA.14 | v43.25,62 41.25,64 41.25,73.25 40.25,74.25 JP2.20
  Bottom 0.203: v43.25,62 v49.25,56
D14  (via drill 0.3)
  Top 0.203: ATMEGA.15 51.75,51.5 v51.75,52.5 | v27.5,59.5 27.5,71.75 JP2.9
  Bottom 0.203: v51.75,52.5 50.75,51.5 35.5,51.5 v27.5,59.5
D15  (via drill 0.3)
  Top 0.203: v49.25,57 52.75,53.5 52.75,51.25 ATMEGA.16 | v37,63.25 33.75,66.5 33.75,74.75 33,75.5 27.5,75.5 27.5,74.5 JP2.10
  Bottom 0.203: v49.25,57 43,63.25 v37,63.25
D18  (via drill 0.3)
  Top 0.203: v56.75,55.25 56.75,51.25 ATMEGA.21 | v44,63.25 42.75,64.5 42.75,71.75 JP2.21
  Bottom 0.203: v56.75,55.25 52,55.25 v44,63.25
D19  (via drill 0.3)
  Top 0.203: v55.5,70.25 58.25,67.5 58.25,62 57.5,61.25 57.5,51.25 ATMEGA.22
  Bottom 0.203: v55.5,70.25 55.25,70.5 51.75,70.5 48,74.25 42.75,74.25 JP2.22
D20  (via drill 0.3)
  Top 0.203: RB1.1 24.75,21 v25.75,22 | v58.75,46.5 59.5,47.25 59.5,53 ATMEGA.23
  Bottom 0.203: v25.75,22 25.75,37.75 53,37.75 60,44.75 60,45.5 59.75,45.5 v58.75,46.5
D21  (via drill 0.3)
  Top 0.203: v58.5,52 58,52.5 58,54 59,54 ATMEGA.24 | v54,48 48.5,42.5 48.5,35 51,32.5 58.5,32.5 58.5,30.5 74HC595.14
  Bottom 0.203: v58.5,52 54.5,48 v54,48
D22  (via drill 0.3)
  Top 0.203: v63.5,22.5 63.25,22.75 63.25,29.5 63,29.75 | 63,29.75 62.75,30 74HC595.11 | v63,51.75 60.25,54.5 59.5,54.5 ATMEGA.25 | 63,29.75 v63,39.25
  Bottom 0.203: v63.5,22.5 68.5,17.5 86.25,17.5 94,9.75 EXTOUT.4 | v63,39.25 v63,51.75
D23  (via drill 0.3)
  Top 0.203: v29,26.25 28,25.25 RB2.1 | v63.75,52.5 61,55.25 59.5,55.25 ATMEGA.26
  Bottom 0.203: v29,26.25 30.75,28 49,28 59.5,38.5 63.25,38.5 63.75,39 v63.75,52.5
D+  (via drill 0.3)
  Top 0.203: v34.5,42.75 34.5,45.25 35,45.75 CH340.5
  Bottom 0.203: v34.5,42.75 31.25,39.5 8.75,39.5 7.5,38.25 USB.D+
D-  (via drill 0.3)
  Top 0.203: v35.75,42.75 35.75,45.25 36.25,45.75 CH340.6
  Bottom 0.203: v35.75,42.75 31.25,38.25 9.5,38.25 USB.D-
DCIN
  Top 0.61: R0.2 6.15,25.45 1.1,20.4 1.1,6.35 4.1,3.35 9,3.35 11.1,5.45 11.91,5.45 D1.A
DCIN_PRE  (via drill 0.3)
  Top 0.61: J.3 2.51,53.34 4.4,51.45 4.4,49 1.15,45.75 1.15,27.15 R0.1 2.65,25.9 v4.25,27.5 | QP1.2 24.85,29.55 RP1.1 24.75,28.4 v24.85,28.3 | v19.15,16.15 19.15,14.72 D2.C 19.45,11.97 D4.A
  Bottom 0.61: v4.25,27.5 7.8,27.5 v19.15,16.15 24.85,21.85 v24.85,28.3
GND  (via drill 0.3)
  Top 0.203: JP2.6 22.38,76.18 22.75,76.55 22.75,79.14 U$4.3 | 34063.4 37.53,33.41 CT.2 | 63.45,57.25 C4.2 63.5,58.25 64,58.75 v64,66 | 63.45,57.25 63.45,56.08 C3.2 | RJ45.G- RJ45.Y- | 42,53.25 42,60 42.25,60.25 44.5,60.25 44.5,59.5 CA0.2 44.75,59.25 45.5,58.5 45.5,57.25 47.75,57.25 ATMEGA.6 | 42,53.25 42,52.25 43.75,52.25 44.5,53 CA1.2 | v53.25,64.75 53.5,64.5 53.5,63 ATMEGA.39 | C5.2 v55.5,66 | 39.5,53.25 38.75,53.25 38.75,70.75 37.75,71.75 JP2.17 | 39.5,53.25 42,53.25 | B1.2 100,68.25 101,67.25 101,59.5 100,58.5 B2.2 100,58.25 101,57.25 101,49.25 100,48.25 B3.2 | C12.2 75.75,48 75.75,47.5 | 75.75,47.5 75.75,46 ENC28J60.2 | v90,47.75 90,55.25 90.5,55.75 C7.1 | v85.25,47.5 RBS.1 | v77.75,47.5 75.75,47.5 | 63.45,57.25 59.5,57.25 ATMEGA.28 | 63.5,57.25 63.45,57.25 | ENC28J60.22 79,53.25 79.75,53.25 ENC28J60.21 79.75,53.5 79.75,54 81.25,55.5 | 81.25,55.5 81.75,55 81.75,53.5 ENC28J60.18 81.75,53.25 v81.75,47.5 81.75,46 ENC28J60.11 81.7,45.9 81.7,45.35 80.7,44.35 80.35,44.35 80.3,44.3 C6.1 80.25,43.5 77,40.25 77,19.5 | 81.25,55.5 CE1.2 81.25,55.75 82.25,56.75 82.25,58.25 82,58.5 | 24.5,22.75 24,22.75 QB1.2 24.5,22.75 | 14.75,29.25 7805.3 | 29.75,48 C10.1 | 29.75,48 29.75,46 CH340.1 | C9.2 54,28.75 49.25,28.75 49.25,29.25 ZB.A | X.2 38.25,43.5 38.5,43.25 38.5,42 | 38.5,34.5 CT.2 | 30.5,45 30.5,45.25 30,45.75 CH340.1 | 32.25,43.25 33.5,42 38.5,42 | 32.25,43.25 30.5,45 | 38.75,42 42.5,42 48.5,48.15 52,48.15 54.5,50.5 | 38.75,42 38.5,42 | 29.75,45 29.75,45.75 CH340.1 | RJ45.SHIELD1 92.25,17.5 92.25,33.5 RJ45.SHIELD0 | 62.25,40 63.25,40 63.75,39.5 64.5,39.5 65,40 65,40.5 24AA.2 | 62.25,40 62.25,36.25 DS1307.4
  Top 0.203: 54.5,50.5 54.75,50.25 54.75,42.5 C8.2 55.8,41.2 56.7,41.2 57.85,40.4 58.4,40 62.25,40 | 54.5,50.5 54.5,51.25 ATMEGA.18 | 74HC595.8 65.25,24 72.5,24 75.5,21 | 67.5,67 MICROSD.GND3 67.75,67 67.75,69.25 | MICROSD.P$1 66.75,76.5 v66.75,70 66.75,69.25 67.75,69.25 | CE0.2 75,55.75 74,56.75 74,58 78.25,62.25 82,58.5 | MICROSD.GND1 82,67 82,58.5 | 82,67.5 82,67.25 MICROSD.GND1 | 82,67.5 82,69.25 | 82,69.25 82,76.5 MICROSD.P$2 | 82,67.5 MICROSD.GND1 | 77.75,69.25 67.75,69.25 | 29.75,48 32.25,50.5 39.5,50.5 39.5,53.25 | 80.11,16.38 ZS.A | 14,29 7805.3 | 16,38.5 16.2,38.4 | 7.5,34.5 7.5,34.65 7.75,34.5 16.2,34.5 | 11,43.5 11.1,43.5 11.25,43.5 14,40.75 C1.- 14,40.5 10.5,37 9,37 7.75,35.75 USB.GND | 30.5,45 23,45 22.5,45.5 22.5,47 17.5,52 1117.1 16,52 11.5,47.5 C2.- 11,48 5.5,53.5 5.5,61.5 7,63 LCD.1.GND | 77.75,69.25 77.75,66.5 MICROSD.6 | 82,69.25 77.75,69.25 | 83,13.25 80,16.25 ZS.A | 75.5,21 77,19.5 | 77,19.5 80,16.5 ZS.A | 75.5,21 BAT.P$1 | 83,13.25 87.5,8.75 TVS9.A | 83,13.25 RS.1 | 5,6.5 9.5,6.5 CH.2 | 5,6.5 5,8.25 4.25,9 4.25,17.75 4.5,18 J1.GND 4.75,18.25 4.75,19 14,28.25 14,28.75 7805.3 | 5,6.5 C0.- | 24.5,22.75 29.75,22.75 QB2.2 30.75,24 30.75,28.5 33,30.75 33,34.75 32.25,35.5 32.25,43.25 | 38.75,42 38.75,36.25 | 38.75,36.25 38.75,34.5 CT.2 | 38.75,36.25 43.5,31.5 CB.-
  Top 0.305: 34063.4 35.16,33.41 34.55,32.8 34.55,31.6 35.3,30.85 36.06,30.85 34063.2 | CB.- 45.99,31.41 RB.2 48.2,30.4 ZB.A | CV.2 73.9,42.2 75.8,44.1 75.8,45.92 ENC28J60.2 | 11.1,48.25 C2.- 11.4,47.3 | 16.1,52 1117.1
  Top 0.61: C2.- 11.1,43.5 | 14.05,28.9 7805.3 16.2,34.5 16.2,38.4 16.5,38.5 20.05,38.5 21,39.45 CL.2 | USB.GND 7.5,34.65
  Top 0.813: TVS9.A 87.9,4.63 RAIN.2
  Bottom 0.203: v53.25,64.75 54.5,66 v55.5,66 v64,66 65.5,66 65.5,70 | JP2.17 37.5,72 35.25,72 JP2.15 34,70.75 26.25,70.75 | JP2.6 23.75,73 23.75,70.75 26.25,70.75 | B3.2 99.75,48 99.25,47.5 90.25,47.5 v90,47.75 85.5,47.75 v85.25,47.5 v81.75,47.5 v77.75,47.5 | RJ45.GND 86.25,30 89.25,33 91.5,33 92,33.5 RJ45.SHIELD0 92.25,33.5 96,33.5 99.75,29.75 RJ45.Y- | 88.63,6 101.25,6 101.25,20 100,21.25 RJ45.G- | 61.75,70.5 65,70.5 65.5,70 | 61.75,70.5 59.25,70.5 57.5,72.25 RF.3 | v66.75,70 65.5,70 | 61.75,70.5 61.75,76 27.5,76 26.25,74.75 26.25,70.75
  Bottom 1.422: RAIN.2 88.63,6 88.63,9.07 SP9.2
  pour Top (isolate 0.61): 0,84 104,84 104,0 0,0
  pour Bottom (isolate 0.813): 0,84 104,84 104,0 0,0
INT0  (via drill 0.3)
  Top 0.203: v47,52.25 ATMEGA.11 | v33.5,57.25 33.5,65.5 30,69 JP2.11
  Bottom 0.203: v47,52.25 46,53.25 37.5,53.25 v33.5,57.25
INT1
  Top 0.203: RC.1 49.75,49.25 49.75,51.25 ATMEGA.12
INT2  (via drill 0.3)
  Top 0.203: v44,72.25 44,71.75 51,64.75 51,63 ATMEGA.42
  Bottom 0.203: v44,72.25 43,73.25 31,73.25 30,74.25 JP2.12
LEDA
  Top 0.203: REA.2 97.25,37.25 102.6,31.9 102.6,21.5 100,18.9 RJ45.G+
LEDB
  Top 0.203: REB.2 97.25,34.85 99.95,32.15 RJ45.Y+
MISO  (via drill 0.3)
  Top 0.203: v80.25,51.5 78.5,49.75 78.5,46 ENC28J60.6 | v74.5,53.75 73.5,54.75 73.5,59.5 77.5,63.5 | 77.5,63.5 78.75,64.75 MICROSD.7 | ATMEGA.2 45,60.25 45,61.25 42,64.25 v42,65.75 | v76.25,64.75 77.5,63.5
  Bottom 0.203: U$4.5 17.3,78.77 17.3,77.5 15.95,76.15 15.95,73.5 17.3,72.15 JP2.1 17.5,71.75 20,69.25 38.5,69.25 v42,65.75 42.25,65.5 44.75,65.5 46.25,64 53.5,64 54.5,65 76,65 v76.25,64.75 | v80.25,51.5 78,53.75 v74.5,53.75
MOSI  (via drill 0.3)
  Top 0.203: JP2.4 19.84,76.19 20.25,76.6 20.25,79.18 U$4.2 | 71.5,51.5 71.5,60.25 74.25,63 74.25,66.25 MICROSD.3 | 71.5,51.5 71.5,41.25 75,41.25 79,45.25 79,45.75 ENC28J60.7 | v43.5,66.25 43.5,65.5 47.75,61.25 ATMEGA.1 | 71.5,51.5 67,51.5 67,65.5 65.5,67 65.5,70 65,70.5 64,70.5 v64,69
  Bottom 0.203: 43,66.75 39.5,70.25 22.25,70.25 21,71.5 21,73 19.75,74.25 JP2.4 | 43,66.75 v43.5,66.25 | v64,69 61.75,66.75 43,66.75
N$1
  Bottom 0.61: J1.PWR 8.6,18.1 5.4,14.9 3.45,14.9 1.7,16.65 1.7,46.2 4.35,48.85 4.35,53.89 J.2
N$2
  Top 0.305: QP1.1 22.95,29.55 RP1.2 23.05,27.15 RQ1.1
N$3  (via drill 0.3)
  Top 0.203: v53,29.5 48,34.5 48,45.5 49.5,47 RC.2
  Top 0.813: TVS9.C 83.5,3.95 RAIN.1
  Bottom 0.203: v53,29.5 55.5,29.5 68,17 84,17 87.5,13.5 83.5,9.5 SP9.1 83.5,9 83.5,4 RAIN.1
N$4
  Top 0.203: R14.2 61.35,19.3 61.35,24 74HC595.5
N$5
  Top 0.203: R15.2 65.7,19.3 62.6,22.4 62.6,24 74HC595.6
N$6
  Top 0.203: X.1 36.95,45.17 CH340.7
N$7
  Top 0.203: R16.2 70.6,19.3 69.7,20.2 67.2,20.2 63.9,23.5 63.9,24 74HC595.7
N$8
  Top 0.203: X0.1 55.79,38.88 DS1307.1
N$9
  Top 0.61: D3.A 34063.1 36.02,29.65 34.55,29.65 33.82,30.38 L1.P$2
N$10
  Top 0.203: R13.2 57.1,19.3 60.05,22.25 60.05,24 74HC595.4
N$11
  Top 0.203: R12.2 52.35,19.3 54.6,21.55 56.8,21.55 58.8,23.55 58.8,24 74HC595.3
N$12
  Top 0.203: R11.2 47.4,19.3 50.05,21.95 55.95,21.95 57.55,23.55 57.55,24 74HC595.2
N$13
  Top 0.203: R10.2 44.6,19.3 47.65,22.35 55.3,22.35 56.25,23.3 56.25,24 74HC595.1
N$14
  Top 0.203: R9.2 39.6,19.3 42.1,21.8 46.55,21.8 47.5,22.75 50.95,22.75 57.55,29.35 57.55,30.15 74HC595.15
N$15
  Top 0.203: CA0.1 42.92,57.23 XA.1 42.9,56.75 43.6,56.05 47.6,56.05 ATMEGA.7
N$16
  Top 0.61: Q1.3 33.1,14.45 31.75,13.1 31.75,9.25 TVS1.C
  Top 0.813: TVS1.C 33.7,4.34 S12.1
  Bottom 1.422: SP1.2 34.4,5.04 S12.1
N$17
  Top 0.61: Q2.3 38.25,14.45 36.85,13.05 36.85,8.6 38.7,6.75
  Top 0.813: TVS2.C 38.7,6.75 38.7,4.26 S12.2
  Bottom 1.422: SP2.2 39.4,4.96 S12.2
N$18
  Top 0.61: Q3.3 43.15,14.45 41.85,13.15 41.85,8.65 43.7,6.8
  Top 0.813: TVS3.C 43.7,6.8 43.7,4.18 S34.1
  Bottom 1.422: SP3.2 44.4,4.88 S34.1
N$19
  Top 0.203: CA1.1 44.6,54.88 XA.3 46,55 46.3,55.3 47.65,55.3 ATMEGA.8
N$20
  Top 0.61: Q4.3 48.15,14.45 46.8,13.1 46.8,8.7 48.7,6.8
  Top 0.813: TVS4.C 48.7,6.8 48.7,4.1 S34.2
  Bottom 1.422: SP4.2 49.4,4.8 S34.2
N$21
  Top 0.305: QB2.3 33.25,23.95 RQ2.2
N$22
  Top 0.61: Q5.3 53,14.45 51.9,13.35 51.9,9.1 TVS5.C
  Top 0.813: TVS5.C 53.7,4.02 S56.1
  Bottom 1.422: SP5.2 54.4,4.72 S56.1
N$23
  Top 0.61: Q6.3 58.3,14.45 56.9,13.05 56.9,8.05 58.7,6.25
  Top 0.813: TVS6.C 58.7,6.25 58.7,3.94 S56.2
  Bottom 1.422: SP6.2 59.4,4.64 S56.2
N$24
  Top 0.61: Q7.3 63.25,14.45 61.75,12.95 61.75,8.75 63.7,6.8
  Top 0.813: TVS7.C 63.7,6.8 63.7,3.94 S78.1
  Bottom 1.422: SP7.2 64.4,4.56 S78.1
N$25
  Top 0.61: Q8.3 68.3,14.45 66.7,12.85 66.7,9.3 TVS8.C
  Top 0.813: TVS8.C 68.7,4.02 S78.2
  Bottom 1.422: SP8.2 69.4,4.48 S78.2
N$26
  Top 0.61: RDC.1 27.5,27.8 RSC.1 28.21,30.86 34063.7 29.94,30.85 31.55,30.85 32.35,31.65 32.35,34.25 29.98,36.62 L1.P$1
N$27
  Top 0.61: QP1.3 25.8,33.55 RSC.2 27.79,32.13 34063.6
N$28
  Top 0.203: 34063.3 38.01,32.13 CT.1
N$29  (via drill 0.3)
  Top 0.203: v42.5,28.75 47,28.75 RB.1 | v30,34.25 29.75,34 29.75,33.5 34063.5
  Top 0.305: RB.1 RT.2
  Bottom 0.203: v42.5,28.75 37,34.25 v30,34.25
N$30
  Top 0.203: X0.4 56.47,35.93 58.1,34.3 58.9,34.3 59.8,35.2 59.8,36.14 DS1307.2
N$31
  Top 0.61: 34063.8 29.93,28.53 RDC.2
N$32
  Top 0.305: QB1.1 22.1,21.15 RB1.2
N$33
  Top 0.305: RQ1.2 24.5,26.35 QB1.3
N$34  (via drill 0.3)
  Top 0.203: v95.25,48.25 95.25,38.25 95.5,38 REA.1 | v76,50.75 75.75,51 75.75,53.25 ENC28J60.27
  Bottom 0.203: v95.25,48.25 94.5,49 77.75,49 v76,50.75
N$35
  Top 0.406: Q1.1 34.8,16.7 R1.2 35.65,18.35 R9.1
N$36  (via drill 0.3)
  Top 0.203: v61.5,34.5 61.5,35.75 61.25,36 DS1307.3 | v73.75,35 75.5,36.75 BAT.P$2
  Bottom 0.203: v61.5,34.5 62,35 v73.75,35
N$37  (via drill 0.3)
  Top 0.203: v94.25,48.25 94.25,37.25 95.5,36 REB.1 | v76.75,48.5 76.75,52.25 76.5,52.5 76.5,53.25 ENC28J60.26
  Bottom 0.203: v94.25,48.25 94,48.5 v76.75,48.5
N$38
  Top 0.305: QP2.1 35.35,22.7 RP2.2 35.45,22.6 RQ2.1
N$39
  Top 0.305: CV.1 73.55,44.32 ENC28J60.1
N$40
  Top 0.203: X.3 39.35,45.3 CH340.8
N$41
  Top 0.203: CE0.1 75.28,57.48 XE.3 77,55 77.75,54.25 77.75,53.28 ENC28J60.24
N$42
  Top 0.203: CE1.1 79.22,57.48 XE.1 79.05,57.45 78.1,56.5 78.1,54.5 78.45,54.15 78.45,53.28 ENC28J60.23
N$43
  Top 0.305: RB2.2 28.4,23.55 QB2.1
N$44
  Top 0.406: Q2.1 39.8,16.7 R2.2 40.75,18.25 R10.1
N$45
  Top 0.406: Q3.1 44.8,16.7 R3.2 45.65,18.35 R11.1
N$46
  Top 0.406: Q4.1 49.7,16.8 R4.2 49.75,18.3 50.55,18.3 51.25,17.6 R12.1
N$47
  Top 0.406: Q5.1 54.8,16.7 R5.2 55.65,18.35 R13.1
N$48
  Top 0.406: R14.1 61.35,17.6 60.7,18.25 59.8,18.25 | 59.8,18.25 R6.2 | 59.8,18.25 59.8,16.7 Q6.1
N$49
  Top 0.406: Q7.1 64.7,16.8 R7.2 64.8,18.25 65.7,18.25 66.35,17.6 R15.1
N$50
  Top 0.406: R16.1 70.55,18.45 R8.2 69.8,16.7 Q8.1
N$54
  Top 0.203: C6.2 RR-.1 82.5,41.95 82.55,42 RR+.2
N$59
  Top 0.203: RBS.2 85.4,45.8 85.3,45.9 83.65,45.9 ENC28J60.14
QH*  (via drill 0.3)
  Top 0.203: v65.75,28.5 65.75,29.5 65.25,30 74HC595.9
  Bottom 0.203: v65.75,28.5 75,19.25 92.5,19.25 95.5,16.25 95.5,7.25 94.25,7.25 EXTOUT.2
RD+
  Top 0.203: ENC28J60.13 83,45.9 83,43.75 83.05,43.7 RR+.1 83.5,43.5 84.5,42.5 84.5,25 86,23.5 88.5,23.5 RJ45.RD+
RD-
  Top 0.203: RR-.2 82.3,43.65 82.35,43.7 82.35,45.9 ENC28J60.12 82.25,46 82.5,46.25 82.5,46.75 84.25,48.5 87.25,48.5 87.25,41.75 85,39.5 85,28.5 86,27.5 RJ45.RD-
RECDC
  Top 0.61: 7805.1 13.2,23.75 7.5,18.05 7.5,17 5.7,15.2 5.7,10.95 C0.+ 7.4,8.55 CH.1 10.96,8.55 D1.C
RESET  (via drill 0.3)
  Top 0.203: C11.2 34.25,53.75 36,53.75 RR.1 36.25,53.75 37,54.5 v37,54.75 | v81,49.75 81,46 ENC28J60.10 | v67.75,54.5 v69.25,53 | v50.25,58 49.75,58.5 48,58.5 ATMEGA.4 | v24.25,68 24.25,70 22.5,71.75 JP2.5
  Bottom 0.203: JP2.5 22.38,72.37 21.15,73.6 21.15,74.95 22.85,76.65 22.85,79.24 U$4.7 | v81,49.75 77.75,53 v69.25,53 | v67.75,54.5 67,55.25 57.75,55.25 | 57.75,55.25 54.75,58.25 52.25,58.25 52,58 v50.25,58 | 40.5,54.75 56.25,54.75 56.5,54.5 57,54.5 57.75,55.25 | 40.5,54.75 v37,54.75 | v24.25,68 28.75,63.5 31.75,63.5 40.5,54.75
RTS
  Top 0.203: C11.1 32.5,53.5 32.5,51.5 CH340.14
RXD
  Top 0.203: CH340.2 31.25,46 32.25,47 32.25,48.75 33.5,50 45.5,50 45.5,53 47,54.5 47.75,54.5 ATMEGA.9
SCK  (via drill 0.3)
  Top 0.203: v79.75,49.75 79.75,46 ENC28J60.8 | v70.75,52.25 71,52.5 71,59.5 | 71,59.5 71,67 71.5,67.5 76.5,67.5 76.5,66.5 MICROSD.5 | v50,59.5 48,59.5 ATMEGA.3 | 71,59.5 v70.75,59.5 | v22.75,68.5 22.75,69 20,71.75 JP2.3
  Bottom 0.203: JP2.3 19.84,72.46 18.6,73.7 18.6,74.95 20.25,76.6 20.25,79.18 U$4.6 | v79.75,49.75 77.25,52.25 v70.75,52.25 | v70.75,59.5 v50,59.5 45.5,64 42.75,64 38,68.75 23,68.75 v22.75,68.5
SCL  (via drill 0.3)
  Top 0.203: U$4.4 25.35,79.2 25.35,76.5 24.92,76.07 JP2.8 25,74.25 26,73.25 26,68 13.75,55.75 7,55.75 LCD.4.SCL | 24AA.1 64.25,40.75 61.25,40.75 61.25,42.25 DS1307.6 61,42.5 61,44.75 60.75,45 RCL.1 v59.25,45 | v57.75,45 55.25,47.5 55.25,51.25 ATMEGA.19
  Bottom 0.203: v59.25,45 v57.75,45 57.5,45.25 17.25,45.25 7,55.5 LCD.4.SCL
SDA  (via drill 0.3)
  Top 0.203: 24AA.3 66,40.75 66,41.25 65,42.25 62.5,42.25 DS1307.5 62.5,42.5 62.5,44 | 62.5,44 62.5,45 RDA.1 | ATMEGA.20 56,50.25 v58.75,47.5 | 62.5,44 v62.25,44 | LCD.3.SDA 7,58.25 15.5,58.25 25,67.75 25,71.75 JP2.7
  Bottom 0.203: JP2.7 24.92,72.53 23.7,73.75 23.7,74.95 25.45,76.7 25.45,79.3 U$4.8 | v62.25,44 v58.75,47.5 57.5,46.25 17.5,46.25 8.25,55.5 8.25,57.75 7.25,57.75 7,58 LCD.3.SDA
SENSE  (via drill 0.8)
  Top 0.203: RZ.1 82.6,18.1 84.4,16.3 85.55,16.3 88.25,13.6
  Top 0.305: Q1.2 32.95,16.5 33.9,15.55 36.85,15.55 | 36.85,15.55 Q2.2 | 36.85,15.55 41.85,15.55 | 41.85,15.55 Q3.2 | 41.85,15.55 46.85,15.55 | 46.85,15.55 Q4.2 | 46.85,15.55 51.85,15.55 | 51.85,15.55 Q5.2 | 51.85,15.55 56.85,15.55 | 56.85,15.55 Q6.2 | 56.85,15.55 61.85,15.55 | 61.85,15.55 Q7.2 | 61.85,15.55 66.85,15.55 Q8.2
  Top 0.406: R1.1 33.1,16.8 Q1.2 | R2.1 38.1,16.8 Q2.2 | R3.1 43.1,16.8 Q3.2 | R4.1 48,16.7 Q4.2 | R5.1 53.1,16.8 Q5.2 | R6.1 58,16.7 Q6.2 | R7.1 63,16.7 Q7.2 | R8.1 68.1,16.8 Q8.2
  Top 0.61: 56.85,15.55 56.85,14.7 v55.75,13.6
  Top 1.12: v35.5,13.65 35.5,13.5 TVS1.A | v40.55,13.5 40.5,13.5 TVS2.A | v45.7,13.6 45.6,13.6 TVS3.A | v50.75,13.55 50.55,13.55 TVS4.A | v55.75,13.6 55.6,13.6 TVS5.A | v60.7,13.6 60.6,13.6 TVS6.A | v65.75,13.55 65.55,13.55 TVS7.A | v70.8,13.6 70.6,13.6 TVS8.A | v86.15,13.6 88.25,13.6 88.75,13.6 88.75,13.4 RS.2
  Top 1.422: EXTOUT.7 EXTOUT.5 99.03,12.27 100.05,11.25 100.05,7 97.6,4.55 92.7,4.55 91.15,6.1 91.15,10.3 RS.2
  Bottom 1.12: SP1.1 34.4,12.55 v35.5,13.65 40.4,13.65 | SP2.1 39.4,12.35 v40.55,13.5 40.4,13.65 | SP3.1 44.4,12.3 v45.7,13.6 45.65,13.65 | SP4.1 49.4,12.2 v50.75,13.55 50.65,13.65 | SP5.1 54.4,12.25 v55.75,13.6 | SP6.1 59.4,12.3 v60.7,13.6 | SP7.1 64.4,12.2 v65.75,13.55 | SP8.1 69.4,12.2 v70.8,13.6 | 40.4,13.65 45.65,13.65 | 45.65,13.65 50.65,13.65 | 50.65,13.65 55.7,13.65 v55.75,13.6 | v55.75,13.6 v60.7,13.6 | v60.7,13.6 65.7,13.6 v65.75,13.55 | v65.75,13.55 70.75,13.55 v70.8,13.6 | v70.8,13.6 70.8,13.75 73.05,16 77.85,16 80.25,13.6 v86.15,13.6
TCT  (via drill 0.3)
  Top 0.203: RT+.2 RT-.1 89,57.5 89.15,57.65 90.5,57.65 C7.2 | C7.2 L2.1 | v91.5,40 91.5,56.5 90.5,57.5 C7.2
  Bottom 0.203: v91.5,40 84.75,40 84.75,26.25 86,25 RJ45.P4
TD+  (via drill 0.3)
  Top 0.203: RT+.1 84.25,55.8 82.35,53.9 82.35,53.3 ENC28J60.17 82.25,53.25 82.25,52.5 v83.75,51 | v90.75,49.75 90.75,35.5 90,34.75 90,31.5 90.25,31.25 90.25,21.25 88.75,21.25 RJ45.TD+
  Bottom 0.203: v90.75,49.75 89.5,51 v83.75,51
TD-
  Top 0.203: ENC28J60.16 83,53.3 83,54 83.9,54.9 86.45,54.9 87.35,55.8 RT-.2 87.75,55.75 87.75,41.5 86.25,40 86.25,34.5 89.75,31 89.75,22.5 86.25,22.5 RJ45.TD-
TXD  (via drill 0.3)
  Top 0.203: v33,47.75 33,46.5 32.5,46 CH340.3 | v44.75,48.5 46.25,50 46.25,53 47,53.75 47.75,53.75 ATMEGA.10
  Bottom 0.203: v33,47.75 33.75,48.5 v44.75,48.5
VCC  (via drill 0.3)
  Top 0.203: MICROSD.4 75.45,64.15 RSD.2 75,63.75 74.75,63.5 74.75,61.5 72.5,59.25 72.5,53.25 C12.1 | 54.4,64.5 ATMEGA.38 54.25,62.75 54.25,56.75 52,56.75 51.25,56 | 54.4,64.5 54.4,65.4 C5.1 | ATMEGA.27 61.52,56.25 C3.1 61.75,56 v63.75,54 | ENC28J60.28 75.25,53.5 75.25,54.25 76.75,54.25 77,54 77,53.5 ENC28J60.25 77.25,53.25 77.25,52.5 77.5,52.25 81,52.25 | C10.2 27.75,51.5 25.75,49.5 25.75,46 25.25,45.5 23.25,45.5 23.25,49.5 1117.4 | 51.25,56 49.5,57.75 48,57.75 ATMEGA.5 | 51.25,56 53.5,53.75 53.5,51.25 ATMEGA.17 | 36.5,74.5 37.5,74.5 JP2.18 39,75.75 51.25,75.75 51.25,74.25 | 36.5,74.5 35.25,74.5 JP2.16 | 54.4,64.5 54.5,64.5 52,67 ROE.2 51.75,67.25 51.25,67.75 51.25,74.25 | 51.25,74.25 55.5,74.25 56,73.75 56,70.75 59.25,67.5 RPR.2 | 37.75,60.5 37.75,70 36.5,71.25 36.5,74.5 | 37.75,60.5 RR.2 | 37.75,60.5 31.5,54.25 31.5,53 30,51.5 CH340.16 30,51.25 v31,50.25 | v33.75,49.25 33.75,46 CH340.4 | 81,53.25 80.5,53.25 ENC28J60.20 | v83.75,52 83.75,53.25 ENC28J60.15 | 81,53.25 81,52.25 | 81,53.25 ENC28J60.19 | L2.2 88,61.25 82.5,55.75 v82.5,55 | 81,52.25 v81,52 | 64.25,31.25 64,31 64,30.25 74HC595.10 | 64.25,31.25 66.75,33.75 66.75,41.25 66.25,41.75 66.25,43 24AA.4 66,43.25 65.75,43.5 v65.75,54 | v56.5,31.75 56.5,30.25 74HC595.16 | 64.25,31.25 v63.75,31.75
  Top 0.305: C9.1 56.18,30.25 74HC595.16 | C12.1 74.97,53.05 ENC28J60.28 | C10.2 29.8,51.55 CH340.16
  Top 0.61: 1117.4 22.3,49.7 18.75,53.25 11.65,53.25 11.1,52.7 C2.+
  Bottom 0.203: v31,50.25 32.75,50.25 v33.75,49.25 35.5,51 52.75,51 55.75,54 v63.75,54 64,53.75 65.75,53.75 | v81,52 82.5,52 | 82.5,52 v83.75,52 | 82.5,52 82.5,54.5 | 82.5,54.5 v82.5,55 | 65.75,53.75 73.5,53.75 74.25,54.5 82.5,54.5 | v56.5,31.75 v63.75,31.75 71.75,23.75 86.25,23.75 87.5,22.5 98.25,22.5 98.25,8.5 97,7.25 EXTOUT.1 | v65.75,54 65.75,53.75
VIN  (via drill 0.3)
  Top 0.305: U$4.1 17.3,78.77 JP2.2 17.25,74.25 8.25,65.25 8.25,62 7,60.75 LCD.2.VDD | 1117.3 17.1,47.4 17.75,47.4 22,43.15 CL.1 22.25,41 23,40.25 23,38.75 21.75,37.5 21.75,27.25 18.5,24 7805.2 | v64.75,69.75 64.75,49 62.5,46.75 RDA.2 62.25,46.75 60.75,46.75 RCL.2 60.5,46.5 59.75,46.5 58.5,45.25 | C8.1 56.25,42.5 58.25,42.5 DS1307.8 58.5,42.5 58.5,45.25 | USB.VBUS 9.5,35.75 12.5,35.75 17.25,40.5 18.5,40.5 C1.+ | v56.75,47 58.5,45.25
  Top 0.406: v16.1,48.5 17.05,47.55 1117.3
  Top 0.61: 7805.2 18.48,19.45 D2.A | CL.1 20.35,41.15 19.8,40.6 C1.+
  Bottom 0.305: v64.75,69.75 57.5,69.75 55,72.25 RF.2 | v56.75,47 17.75,47 16.25,48.5 v16.1,48.5
  Bottom 0.406: LCD.2.VDD 7,59.9 16.1,50.8 v16.1,48.5

### Text on the board
tNames: OpenSprinkler v2.3 DC | www.opensprinkler.com | VIN MSI GND SCL D15 IN2 A06 VCC VCC D13 D19 | DAT VIN GND | MSO SCK RST SDA D14 IN0 A05 GND GND D12 D18 | PWR | EXTOUT | S1-8 | RAIN